# Altium schematic sheet Eeprom.SchDoc
size A4; SheetNumber: 3; SheetTotal: 16
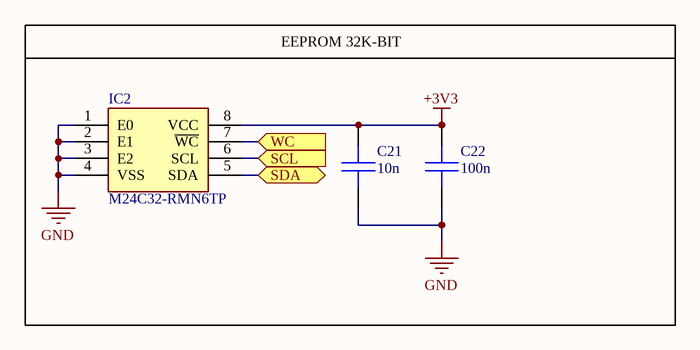
[diagram p0: Eeprom.SchDoc]

## Parts
C21  10n  [C_0603]
C22  100n  [C_0603]
IC2  M24C32-RMN6TP  [SOIC127P600X175-8N]

## Blocks framed on the sheet
EEPROM 32K-BIT: C21 C22 IC2

## Ports
SCL (in, see Interconnections[3A], IO_Expander[2A], Isolator_I2C[2A]), SDA (bidir, see Interconnections[3A], IO_Expander[2A], Isolator_I2C[2A]), WC (in, see Interconnections[3A], IO_Expander[3A])

## Nets
+3V3: C21.1 C22.1 IC2.8(VCC)
GND: C21.2 C22.2 IC2.1(E0) IC2.2(E1) IC2.3(E2) IC2.4(VSS)
SCL: IC2.6(SCL) ; port SCL
SDA: IC2.5(SDA) ; port SDA
WC: IC2.7(~{WC}) ; port WC

## Library data of the parts
C21 C22 = CAP: SMD Chip Capacitor
IC2 = M24C32-RMN6TP: Integrated Circuit; Manufacturer_Name: STMicroelectronics; Datasheet Link: http://www.st.com/content/ccc/resource/technical/document/datasheet/80/4e/8c/54/f2/63/4c/4a/CD00001012.pdf/files/CD00001012.pdf/jcr:content/translations/en.CD00001012.pdf; Height: 1.75mm; Manufacturer_Part_Number: M24C32-RMN6TP; Mouser Part Number: 511-M24C32-RMN6TP; Mouser Price/Stock: https://www.mouser.co.uk/ProductDetail/STMicroelectronics/M24C32-RMN6TP?qs=mxjAf%2Fzt%2FiCvN2%252BVDNbw9w%3D%3D; Arrow Part Number: M24C32-RMN6TP; Arrow Price/Stock: https://www.arrow.com/en/products/m24c32-rmn6tp/stmicroelectronics?region=nac